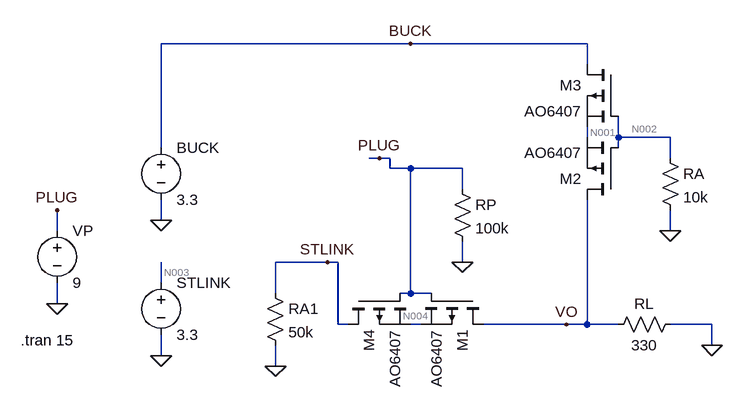
[diagram p0: schematic A2.asc]
A2.asc, the LTspice schematic file:
Version 4
SHEET 1 952 680
WIRE 448 -96 64 -96
WIRE 720 -96 448 -96
WIRE 720 -64 720 -96
WIRE 720 48 720 32
WIRE 768 48 768 16
WIRE 848 48 768 48
WIRE 64 64 64 -96
WIRE 768 64 768 48
WIRE 400 80 384 80
WIRE 416 80 400 80
WIRE 848 80 848 48
WIRE 416 96 416 80
WIRE 448 96 416 96
WIRE 528 96 448 96
WIRE 528 128 528 96
WIRE 64 176 64 144
WIRE -96 192 -96 160
WIRE 848 192 848 160
WIRE 320 240 240 240
WIRE 336 240 320 240
WIRE 528 240 528 208
WIRE 64 272 64 240
WIRE 240 288 240 240
WIRE 448 288 448 96
WIRE 448 288 432 288
WIRE 480 288 448 288
WIRE -96 304 -96 272
WIRE 336 336 336 240
WIRE 352 336 336 336
WIRE 464 336 448 336
WIRE 688 336 560 336
WIRE 720 336 720 144
WIRE 720 336 688 336
WIRE 768 336 720 336
WIRE 912 336 848 336
WIRE 912 368 912 336
WIRE 64 384 64 352
WIRE 240 400 240 368
FLAG -96 304 0
FLAG 64 384 0
FLAG 64 176 0
FLAG 912 368 0
FLAG -96 160 PLUG
FLAG 528 240 0
FLAG 400 80 PLUG
FLAG 848 192 0
FLAG 688 336 VO
FLAG 448 -96 BUCK
FLAG 320 240 STLINK
FLAG 240 400 0
SYMBOL voltage 64 48 R0
WINDOW 123 0 0 Left 0
WINDOW 39 0 0 Left 0
SYMATTR InstName BUCK
SYMATTR Value 3.3
SYMBOL voltage 64 256 R0
WINDOW 123 0 0 Left 0
WINDOW 39 0 0 Left 0
SYMATTR InstName STLINK
SYMATTR Value 3.3
SYMBOL voltage -96 176 R0
WINDOW 123 0 0 Left 0
WINDOW 39 0 0 Left 0
SYMATTR InstName VP
SYMATTR Value 9
SYMBOL pmos 560 288 R90
SYMATTR InstName M1
SYMATTR Value AO6407
SYMBOL pmos 768 144 R180
SYMATTR InstName M2
SYMATTR Value AO6407
SYMBOL res 864 320 R90
WINDOW 0 0 56 VBottom 2
WINDOW 3 32 56 VTop 2
SYMATTR InstName RL
SYMATTR Value 330
SYMBOL res 512 112 R0
SYMATTR InstName RP
SYMATTR Value 100k
SYMBOL res 832 64 R0
SYMATTR InstName RA
SYMATTR Value 10k
SYMBOL pmos 768 -64 M0
SYMATTR InstName M3
SYMATTR Value AO6407
SYMBOL pmos 352 288 M90
SYMATTR InstName M4
SYMATTR Value AO6407
SYMBOL res 224 272 R0
SYMATTR InstName RA1
SYMATTR Value 50k
TEXT -152 360 Left 2 !.tran 15

The netlist it stands for:
* A2.asc
V§BUCK BUCK 0 3.3
V§STLINK N003 0 3.3
VP PLUG 0 9
M1 VO PLUG N004 N004 AO6407
M2 VO N002 N001 N001 AO6407
RL 0 VO 330
RP PLUG 0 100k
RA N002 0 10k
M3 BUCK N002 N001 N001 AO6407
M4 STLINK PLUG N004 N004 AO6407
RA1 STLINK 0 50k
.model NMOS NMOS
.model PMOS PMOS
.lib standard.mos
.tran 15
.backanno
.end

* Results of the author's LTspice run, read from the files saved beside the schematic
* Operating Point, zero values left out:
*   V(buck) = 3.3 V
*   V(n003) = 3.3 V
*   V(plug) = 9 V
*   V(vo) = 3.299 V
*   V(n004) = 3.278 V
*   V(n001) = 3.3 V
*   V(stlink) = 1.628 µV
*   Id(M1) = 32.47 pA
*   Is(M1) = -32.47 pA
*   Id(M2) = -9.998 mA
*   Is(M2) = 9.998 mA
*   Id(M3) = 9.998 mA
*   Is(M3) = -9.998 mA
*   Id(M4) = -29.28 pA
*   Is(M4) = 29.28 pA
*   I(Rl) = -9.998 mA
*   I(Rp) = 90 µA
*   I(Ra1) = 32.56 pA
*   I(Buck) = -9.998 mA
*   I(Vp) = -90 µA
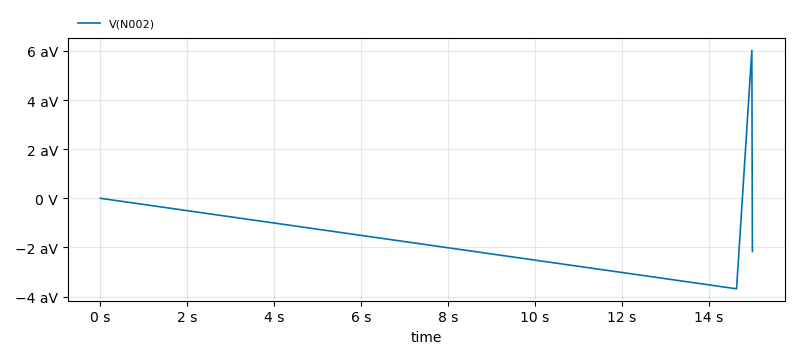
[diagram p1: Transient Analysis of A2.asc, plotted from the saved traces]
* Transient Analysis, 1 run:
*   V(N002): min -0.003685 fV, max 0.006024 fV, average -0.001769 fV, rms 0.002688 fV, last -0.002168 fV